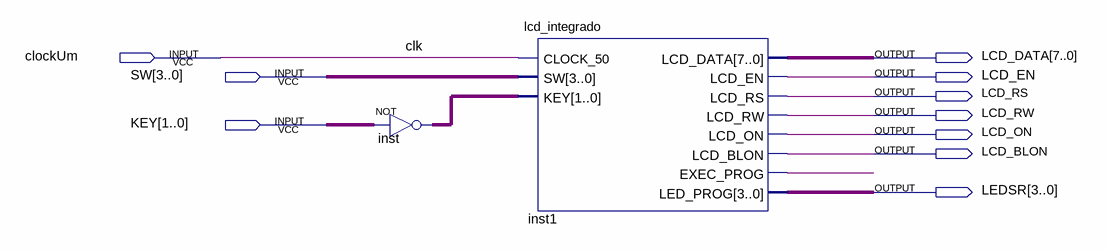
[diagram p0: schematic sheet]
// Quartus schematic testeIntegrado.bdf as structural Verilog: 2 symbols, 10 pins
module testeIntegrado (
  input  clockUm,
  input  [3:0] SW,
  input  [1:0] KEY,
  output [7:0] LCD_DATA,
  output LCD_EN,
  output LCD_RS,
  output LCD_RW,
  output LCD_ON,
  output LCD_BLON,
  output [3:0] LEDSR
);

  wire inst1_exec_prog;
  wire [1:0] inst_out;

  assign inst_out = ~KEY;  // NOT inst, 2 bits wide
  lcd_integrado inst1 (
    .CLOCK_50(clockUm), .SW(SW), .KEY(inst_out), .LCD_DATA(LCD_DATA), .LCD_EN(LCD_EN), .LCD_RS(LCD_RS),
    .LCD_RW(LCD_RW), .LCD_ON(LCD_ON), .LCD_BLON(LCD_BLON), .EXEC_PROG(inst1_exec_prog), .LED_PROG(LEDSR));

  // Other names for the same wires on the sheet: clk = clockUm
endmodule
